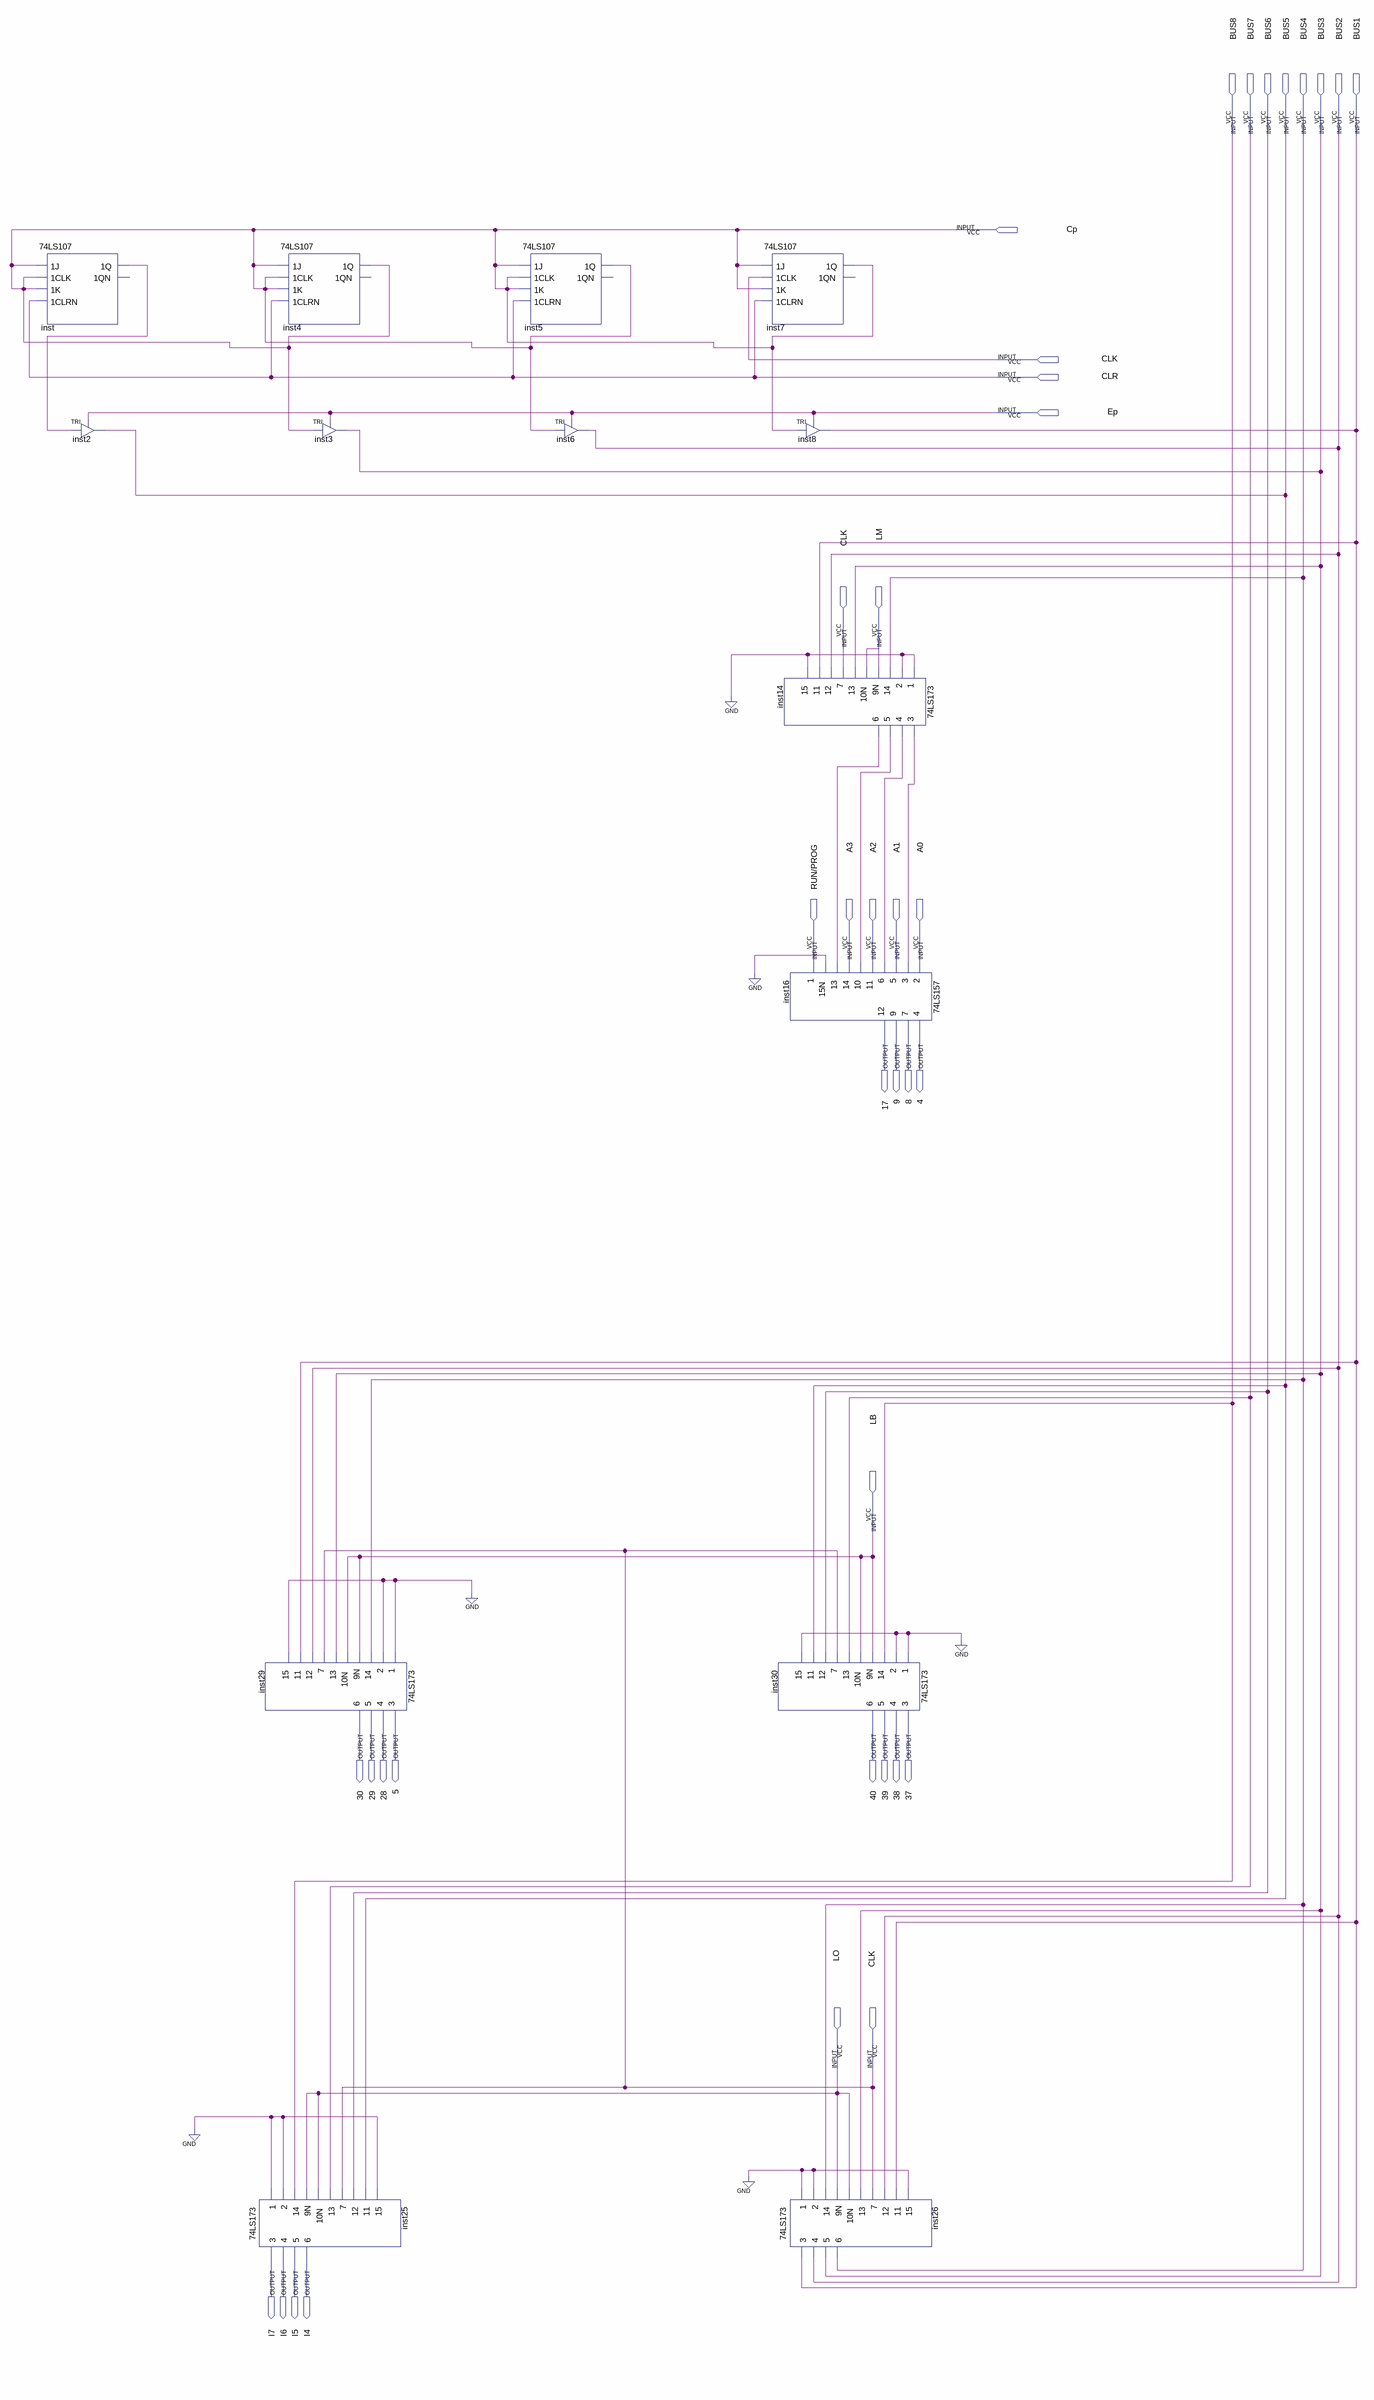
[diagram p0: schematic sheet]
// Quartus schematic Contador de programa, memoria e registrador de instrucoes .bdf as structural Verilog: 14 symbols, 38 pins
module \Contador_de_programa,_memoria_e_registrador_de_instrucoes_  (
  input  BUS8,
  input  BUS7,
  input  BUS6,
  input  BUS5,
  input  BUS4,
  input  BUS3,
  input  BUS2,
  input  BUS1,
  input  Cp,
  input  CLK,
  input  CLR,
  input  Ep,
  input  LM,
  input  \RUN/PROG ,
  input  A3,
  input  A2,
  input  A1,
  input  A0,
  input  LB,
  input  LO,
  output \17 ,
  output \9 ,
  output \8 ,
  output \4 ,
  output \30 ,
  output \29 ,
  output \28 ,
  output \5 ,
  output \40 ,
  output \39 ,
  output \38 ,
  output \37 ,
  output I7,
  output I6,
  output I5,
  output I4
);

  wire inst14_3, inst14_4, inst14_5, inst14_6, inst_1q;

  \74LS107  inst (.\1J (Cp), .\1CLK (Cp), .\1K (Cp), .\1CLRN (CLR), .\1Q (inst_1q));  // open: 1QN
  TRI inst2 (.IN(inst_1q), .OE(Ep), .OUT(BUS5));
  \74LS173  inst29 (
    .\1 (1'b0), .\2 (1'b0), .\14 (BUS4), .\9N (LB), .\10N (LB), .\13 (BUS3), .\7 (CLK), .\12 (BUS2),
    .\11 (BUS1), .\15 (1'b0), .\3 (\5 ), .\4 (\28 ), .\5 (\29 ), .\6 (\30 ));
  \74LS173  inst25 (
    .\1 (1'b0), .\2 (1'b0), .\14 (BUS8), .\9N (LO), .\10N (LO), .\13 (BUS7), .\7 (CLK), .\12 (BUS6),
    .\11 (BUS5), .\15 (1'b0), .\3 (I7), .\4 (I6), .\5 (I5), .\6 (I4));
  \74LS107  inst4 (.\1J (Cp), .\1CLK (Cp), .\1K (Cp), .\1CLRN (CLR), .\1Q (Cp));  // open: 1QN
  TRI inst3 (.IN(Cp), .OE(Ep), .OUT(BUS3));
  \74LS107  inst5 (.\1J (Cp), .\1CLK (Cp), .\1K (Cp), .\1CLRN (CLR), .\1Q (Cp));  // open: 1QN
  TRI inst6 (.IN(Cp), .OE(Ep), .OUT(BUS2));
  \74LS107  inst7 (.\1J (Cp), .\1CLK (CLK), .\1K (Cp), .\1CLRN (CLR), .\1Q (Cp));  // open: 1QN
  \74LS173  inst14 (
    .\1 (1'b0), .\2 (1'b0), .\14 (BUS4), .\9N (LM), .\10N (LM), .\13 (BUS3), .\7 (CLK), .\12 (BUS2),
    .\11 (BUS1), .\15 (1'b0), .\3 (inst14_3), .\4 (inst14_4), .\5 (inst14_5), .\6 (inst14_6));
  \74LS173  inst30 (
    .\1 (1'b0), .\2 (1'b0), .\14 (BUS8), .\9N (LB), .\10N (LB), .\13 (BUS7), .\7 (CLK), .\12 (BUS6),
    .\11 (BUS5), .\15 (1'b0), .\3 (\37 ), .\4 (\38 ), .\5 (\39 ), .\6 (\40 ));
  TRI inst8 (.IN(Cp), .OE(Ep), .OUT(BUS1));
  \74LS157  inst16 (
    .\2 (A0), .\3 (inst14_3), .\5 (A1), .\6 (inst14_4), .\11 (A2), .\10 (inst14_5), .\14 (A3),
    .\13 (inst14_6), .\15N (1'b0), .\1 (\RUN/PROG ), .\4 (\4 ), .\7 (\8 ), .\9 (\9 ), .\12 (\17 ));
  \74LS173  inst26 (
    .\1 (1'b0), .\2 (1'b0), .\14 (BUS4), .\9N (LO), .\10N (LO), .\13 (BUS3), .\7 (CLK), .\12 (BUS2),
    .\11 (BUS1), .\15 (1'b0), .\3 (BUS1), .\4 (BUS2), .\5 (BUS3), .\6 (BUS4));
endmodule
